# Altium schematic sheet IMD.SchDoc: QUTMS - HVBoard V1.1 - IMD
size A3; Author: Jonn Dillon; Organization: QUT Motorsport; Address1: O-120; Address2: O Block; Address3: QUT Gardens Point; Address4: Brisbane, 4000; DocumentNumber: 2; Revision: 2; SheetNumber: 2; SheetTotal: 8
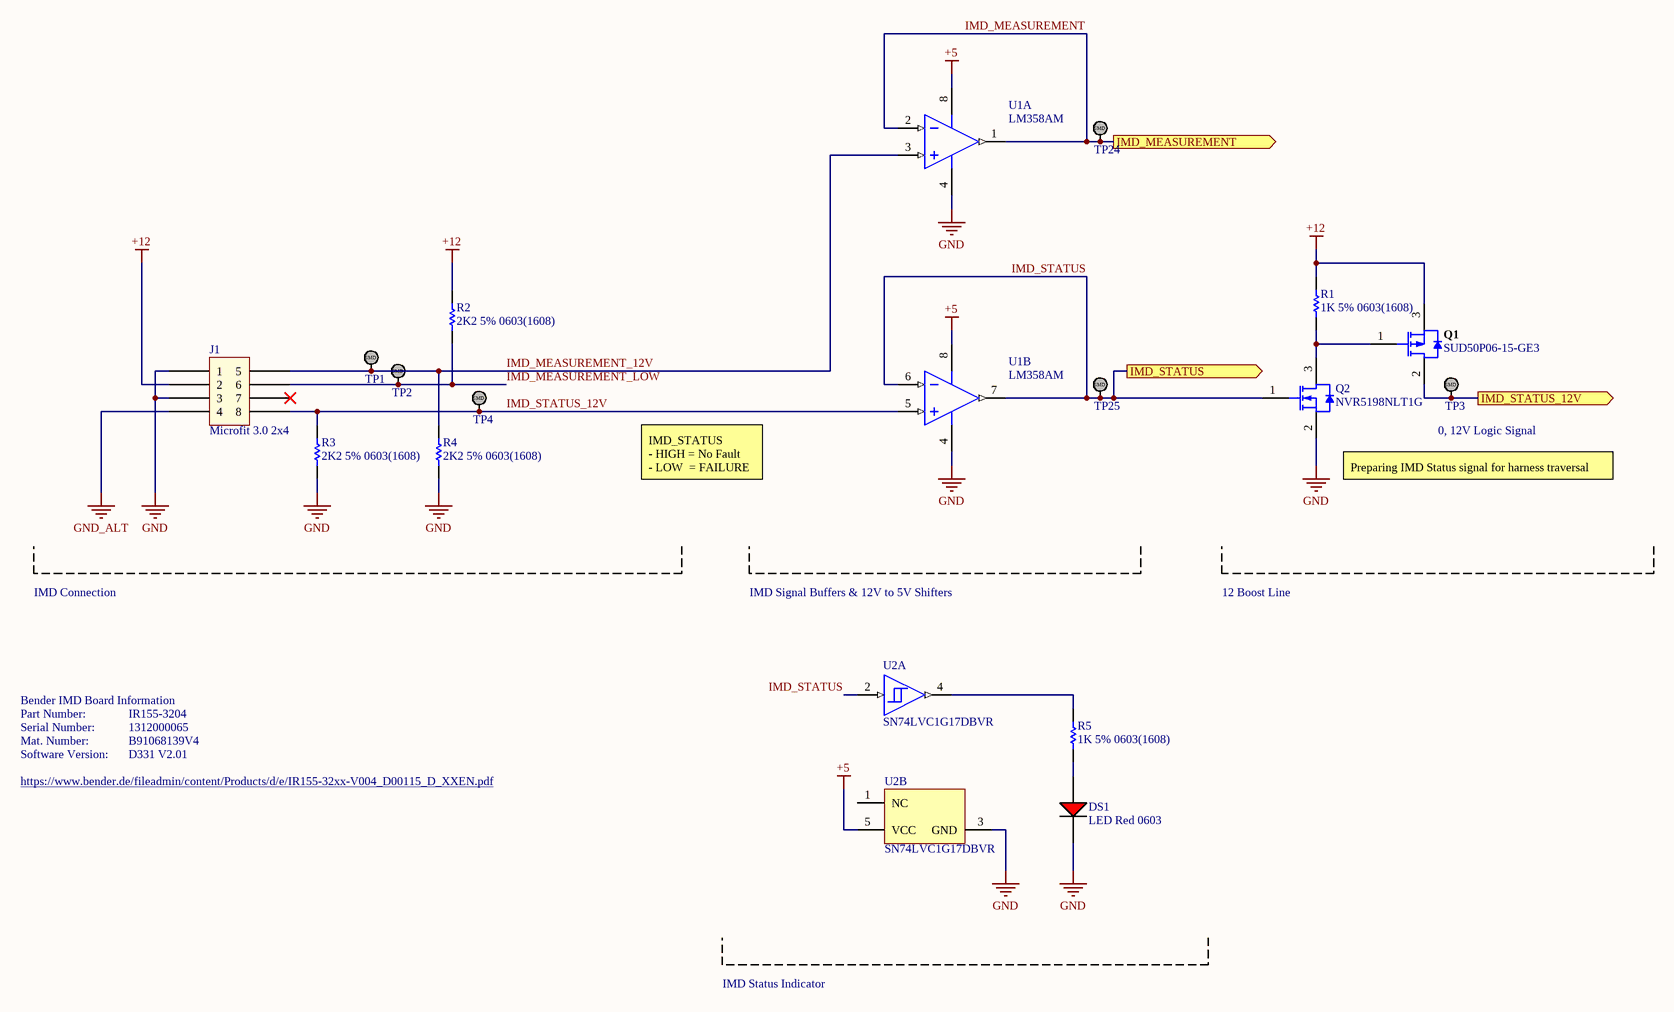
[diagram p0: IMD.SchDoc]

## Parts
DS1  LED Red 0603  [LED RED 0603]
J1  Microfit 3.0 2x4  [Microfit_2X4_R_TH]
Q1  SUD50P06-15-GE3  [VSIL-TO-252AA-3_V]
Q2  NVR5198NLT1G  [ONSC-SOT-23-3-318-08_V]
R1  1K 5% 0603(1608)  [RESC0603(1608)_L]
R2  2K2 5% 0603(1608)  [RESC0603(1608)_N]
R3  2K2 5% 0603(1608)  [RESC0603(1608)_N]
R4  2K2 5% 0603(1608)  [RESC0603(1608)_N]
R5  1K 5% 0603(1608)  [RESC0603(1608)_L]
TP1  TestPoint_SMD  [TestPointSMD]  (value not drawn)
TP2  TestPoint_SMD  [TestPointSMD]  (value not drawn)
TP3  TestPoint_SMD  [TestPointSMD]  (value not drawn)
TP4  TestPoint_SMD  [TestPointSMD]  (value not drawn)
TP24  TestPoint_SMD  [TestPointSMD]  (value not drawn)
TP25  TestPoint_SMD  [TestPointSMD]  (value not drawn)
U1  LM358AM  [D0008A_N]  (parts A,B of 2)
U2  SN74LVC1G17DBVR  [DBV0005A_L]  (parts A,B of 2)

## Ports
IMD_MEASUREMENT (out), IMD_STATUS (out), IMD_STATUS_12V (out)

## Nets
+5: U1.8(V+) U2.5(VCC)
+12: J1.2 Q1.3(S) R1.2 R2.2
GND: DS1.2(C) J1.1 J1.3 Q2.2(S) R3.1 R4.1 U1.4(GND) U2.3(GND)
GND_ALT: J1.4
IMD_MEASUREMENT: TP24.1 U1.1(OUTA) U1.2(INA-) ; port IMD_MEASUREMENT
IMD_MEASUREMENT_12V: J1.5 R4.2 TP1.1 U1.3(INA+)
IMD_MEASUREMENT_LOW: J1.6 R2.1 TP2.1
IMD_STATUS: Q2.1(G) TP25.1 U1.6(INB-) U1.7(OUTB) U2.2(A) ; port IMD_STATUS
IMD_STATUS_12V: J1.8 R3.2 TP4.1 U1.5(INB+)
IMD_STATUS_12V: Q1.2(D) TP3.1 ; port IMD_STATUS_12V  [a separate net that carries the same name]
NetDS1_1: DS1.1(A) R5.1
NetQ1_1: Q1.1(G) Q2.3(D) R1.1
NetR5_2: R5.2 U2.4(Y)

Not connected (* = marked no-connect by the designer): J1 7*; U2 1(NC)

## Notes on the sheet
- (near TP3) 0, 12V Logic Signal
- IMD_STATUS
  - HIGH = No Fault
  - LOW  = FAILURE
- Preparing IMD Status signal for harness traversal
- IMD Connection
- IMD Signal Buffers & 12V to 5V Shifters
- 12 Boost Line
- Bender IMD Board Information
- Part Number:
- Serial Number:
- IR155-3204
- 1312000065
- https://www.bender.de/fileadmin/content/Products/d/e/IR155-32xx-V004_D00115_D_XXEN.pdf
- Mat. Number:
- Software Version:
- B91068139V4
- D331 V2.01
- IMD Status Indicator
- Title
- Size:
- A4
- Number:
- Revision:
- QUT Motorsport, O-120
- O Block, QUT Gardens Point
- Date:
- Time:
- Sheet
- of
- Brisbane, QLD, Australia
- (in symbol TestPoint_SMD) SMD

## Library data of the parts
J1 = Microfit_2x4
Q1 = CMP-2000-05431-1: P-Channel (D-S) MOSFET, 30 V, -55 to 150 degC, 3-Pin TO-252, RoHS, Tape and Reel; Manufacturer: Vishay; Unit Weight: 0.050717oz; Id - Continuous Drain Current: 50A; Rise Time: 70ns; Fall Time: 175ns; Configuration: Single; Rds On - Drain-Source Resistance: 15mOhms; Transistor Type: 1P-Channel; Channel Mode: Enhancement; Number of Channels: 1Channel; Typical Turn-On Delay Time: 15ns; Brand: VishaySemiconductors; Pd - Power Dissipation: 2.5W; Vds - Drain-Source Breakdown Voltage: -60V; Vgs - Gate-Source Voltage: 20V; Mounting Style: SMD/SMT; Package / Case: TO-252AA-3; Height: 2.39mm; Datasheet Version: Rev. C, 07/2013; Factory Pack Quantity: 2000; RoHS: True; Typical Turn-Off Delay Time: 175ns; Minimum Operating Temperature: -55C; Tradename: TrenchFET; Manufacturer URL: http://www.vishay.com/; Package Description: 3-Pin Surface Mount Device, Body 6.54 x 6.095 mm, Pitch 2.28 mm; Package Reference: TO-252; Transistor Polarity: P-Channel; Technology: Si; Series: SUD; Datasheet URL: https://datasheet.ciiva.com/4444/sud50p06-244530-4444327.pdf; Width: 6.22mm; Product Category: MOSFET; Packaging: Reel; Length: 6.73mm; Package URL: http://www.vishay.com/docs/89975/v15wl45c-m3.pdf; Maximum Operating Temperature: +150C
Q2 = CMP-1058-00774-1: Power MOSFET, 60 V, 155 mOhm, Single N-Channel Logic Level, 3-Pin SOT-23, Pb-Free, Tape and Reel; Manufacturer: On Semiconductor; Ciss Typ (pF): 182; Coss Typ (pF): 25; ID Max (A): 2.2; Crss Typ (pF): 16; V(BR)DSS Min (V): 60; Qrr Typ (nC): 6; VGS Max (V): 20; VGS(th) Max (V): 2.5; Channel Polarity: N Channel; Package Type: SOT-23-3; ComponentLink1URL: http://www.onsemi.com/; ComponentLink2Description: Datasheet; ComponentLink1Description: Manufacturer URL; Mounting Technology: Surface Mount; Configuration: Single; Packing: Tape and Reel; RoHS: Pb-Free; ComponentLink3URL: http://www.onsemi.cn/pub_link/Collateral/318-08.PDF; PackageVersion: Rev. AP, 11/2009; PackageReference: SOT-23-3-318-08; DatasheetVersion: Rev. 1; PackageDescription: 3-Pin Small Outline Transistor, Body 2.92 x 1.3 mm, Pitch 0.95 mm; ComponentLink3Description: Package Specification; ComponentLink2URL: http://www.onsemi.com/pub_link/Collateral/NVR5198NL-D.PDF; PartNumber: NVR5198NLT1G
R1 R5 = CMP-1012-00074-1: 1K 0.1W 5% 0603 (1608 Metric)  SMD; Case-EIA: 0603; Case-Metric: 1608; Value: 1000.00 Ohm; Technology: SMT; Tolerance: 5 %; Power: 0.1 W
R2-R4 = CMP-1012-00082-1: 2K2 0.1W 5% 0603 (1608 Metric)  SMD; Case-Metric: 1608; Value: 2200.00 Ohm; Case-EIA: 0603; Power: 0.1 W; Tolerance: 5 %; Technology: SMT
U1 = CMP-0055-00796-3: Low Power Dual Operational Amplifier, 8-pin Narrow SOIC; Manufacturer: Texas Instruments; CompType: Amplifiers; PackageTopMarking: NSZXTT*LM*358AM; PowerWise: N; Code_JEDEC: MS-012-AA; RoHS: N; PinCount: 8; Package Reference: D0008A; ComponentLink1Description: Datasheet URL; ComponentLink1URL: http://www.ti.com/general/docs/lit/getliterature.tsp?genericPartNumber=LM358-N&fileType=pdf; Code_IPC: SOIC127P600-8; PackageDescription: SOIC Narrow, 4.9 x 3.9 x 1.45mm, 8 Lead, 1.27mm Pitch
U2 = CMP-0859-00033-4: Single Schmitt-Trigger Buffer, DBV0005A, LARGE T&R; Manufacturer: Texas Instruments; Output Drive (IOL/IOH)(Max)(mA): 32/-32; Technology Family: LVC; ICC @ Nom Voltage(Max)(mA): 0.01; VCC(Min)(V): 1.65; F @ Nom Voltage(Max)(Mhz): 150; Schmitt Trigger: Yes; Voltage(Nom)(V): 1.8,2.5,3.3,5; 3-State Output: No; Bits(#): 1; VCC(Max)(V): 5.5; Input Type: CMOS/TTL; Logic: True; tpd @ Nom Voltage(Max)(ns): 11,6.5,5.5,5; Output Type: CMOS; Rating: Catalog; Sub-Family: Non-Inverting Buffer/Driver; PackageReference: DBV0005A; DatasheetVersion: SCES351V; Generic Part Number: SN74LVC1G17; Operating Temperature Range(C): -40 to 125,-40 to 85